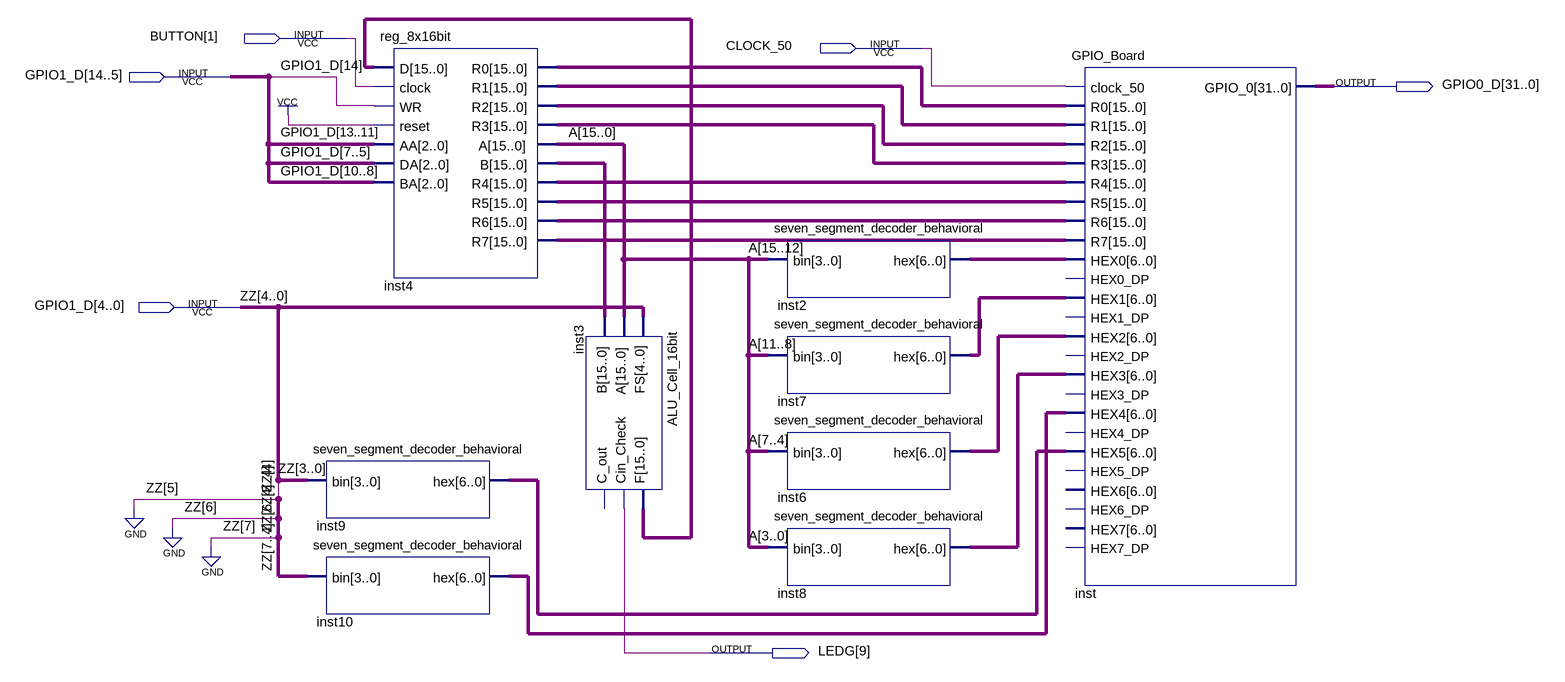
[diagram p0: schematic sheet]
// Quartus schematic Reg16_ALU16_GPIOboard.bdf as structural Verilog: 9 symbols, 6 pins
module Reg16_ALU16_GPIOboard (
  input  [1:1] BUTTON,
  input  CLOCK_50,
  input  [14:0] GPIO1_D,
  output [31:0] GPIO0_D,
  output [9:9] LEDG
);

  wire [6:0] inst2_hex, inst6_hex, inst7_hex, inst8_hex, inst9_hex, inst10_hex;
  wire [15:0] A, inst3_f, inst4_b, inst4_r0, inst4_r1, inst4_r2, inst4_r3, inst4_r4, inst4_r5, inst4_r6,
       inst4_r7;

  seven_segment_decoder_behavioral inst9 (.bin(GPIO1_D[3:0]), .hex(inst9_hex));
  seven_segment_decoder_behavioral inst10 (.bin({3'b000, GPIO1_D[4]}), .hex(inst10_hex));
  reg_8x16bit inst4 (
    .D(inst3_f), .clock(BUTTON[1]), .WR(GPIO1_D[14]), .reset(1'b1), .AA(GPIO1_D[13:11]), .DA(GPIO1_D[7:5]),
    .BA(GPIO1_D[10:8]), .R0(inst4_r0), .R1(inst4_r1), .R2(inst4_r2), .R3(inst4_r3), .A(A), .B(inst4_b),
    .R4(inst4_r4), .R5(inst4_r5), .R6(inst4_r6), .R7(inst4_r7));
  ALU_Cell_16bit inst3 (.FS(GPIO1_D[4:0]), .A(A), .B(inst4_b), .F(inst3_f), .Cin_Check(LEDG[9]));  // open: C_out
  seven_segment_decoder_behavioral inst2 (.bin(A[15:12]), .hex(inst2_hex));
  seven_segment_decoder_behavioral inst7 (.bin(A[11:8]), .hex(inst7_hex));
  seven_segment_decoder_behavioral inst6 (.bin(A[7:4]), .hex(inst6_hex));
  seven_segment_decoder_behavioral inst8 (.bin(A[3:0]), .hex(inst8_hex));
  GPIO_Board inst (
    .clock_50(CLOCK_50), .R0(inst4_r0), .R1(inst4_r1), .R2(inst4_r2), .R3(inst4_r3), .R4(inst4_r4),
    .R5(inst4_r5), .R6(inst4_r6), .R7(inst4_r7), .HEX0(inst2_hex), .HEX1(inst7_hex), .HEX2(inst6_hex),
    .HEX3(inst8_hex), .HEX4(inst10_hex), .HEX5(inst9_hex), .GPIO_0(GPIO0_D));  // open: HEX0_DP, HEX1_DP, HEX2_DP, HEX3_DP, HEX4_DP, HEX5_DP, HEX6, HEX6_DP, HEX7, HEX7_DP

  // Other names for the same wires on the sheet: ZZ[4:0] = GPIO1_D[4:0]
endmodule
